# EasyEDA Pro project Access Control Core.eprj, board V2.0.1 LCD Backpack PCB
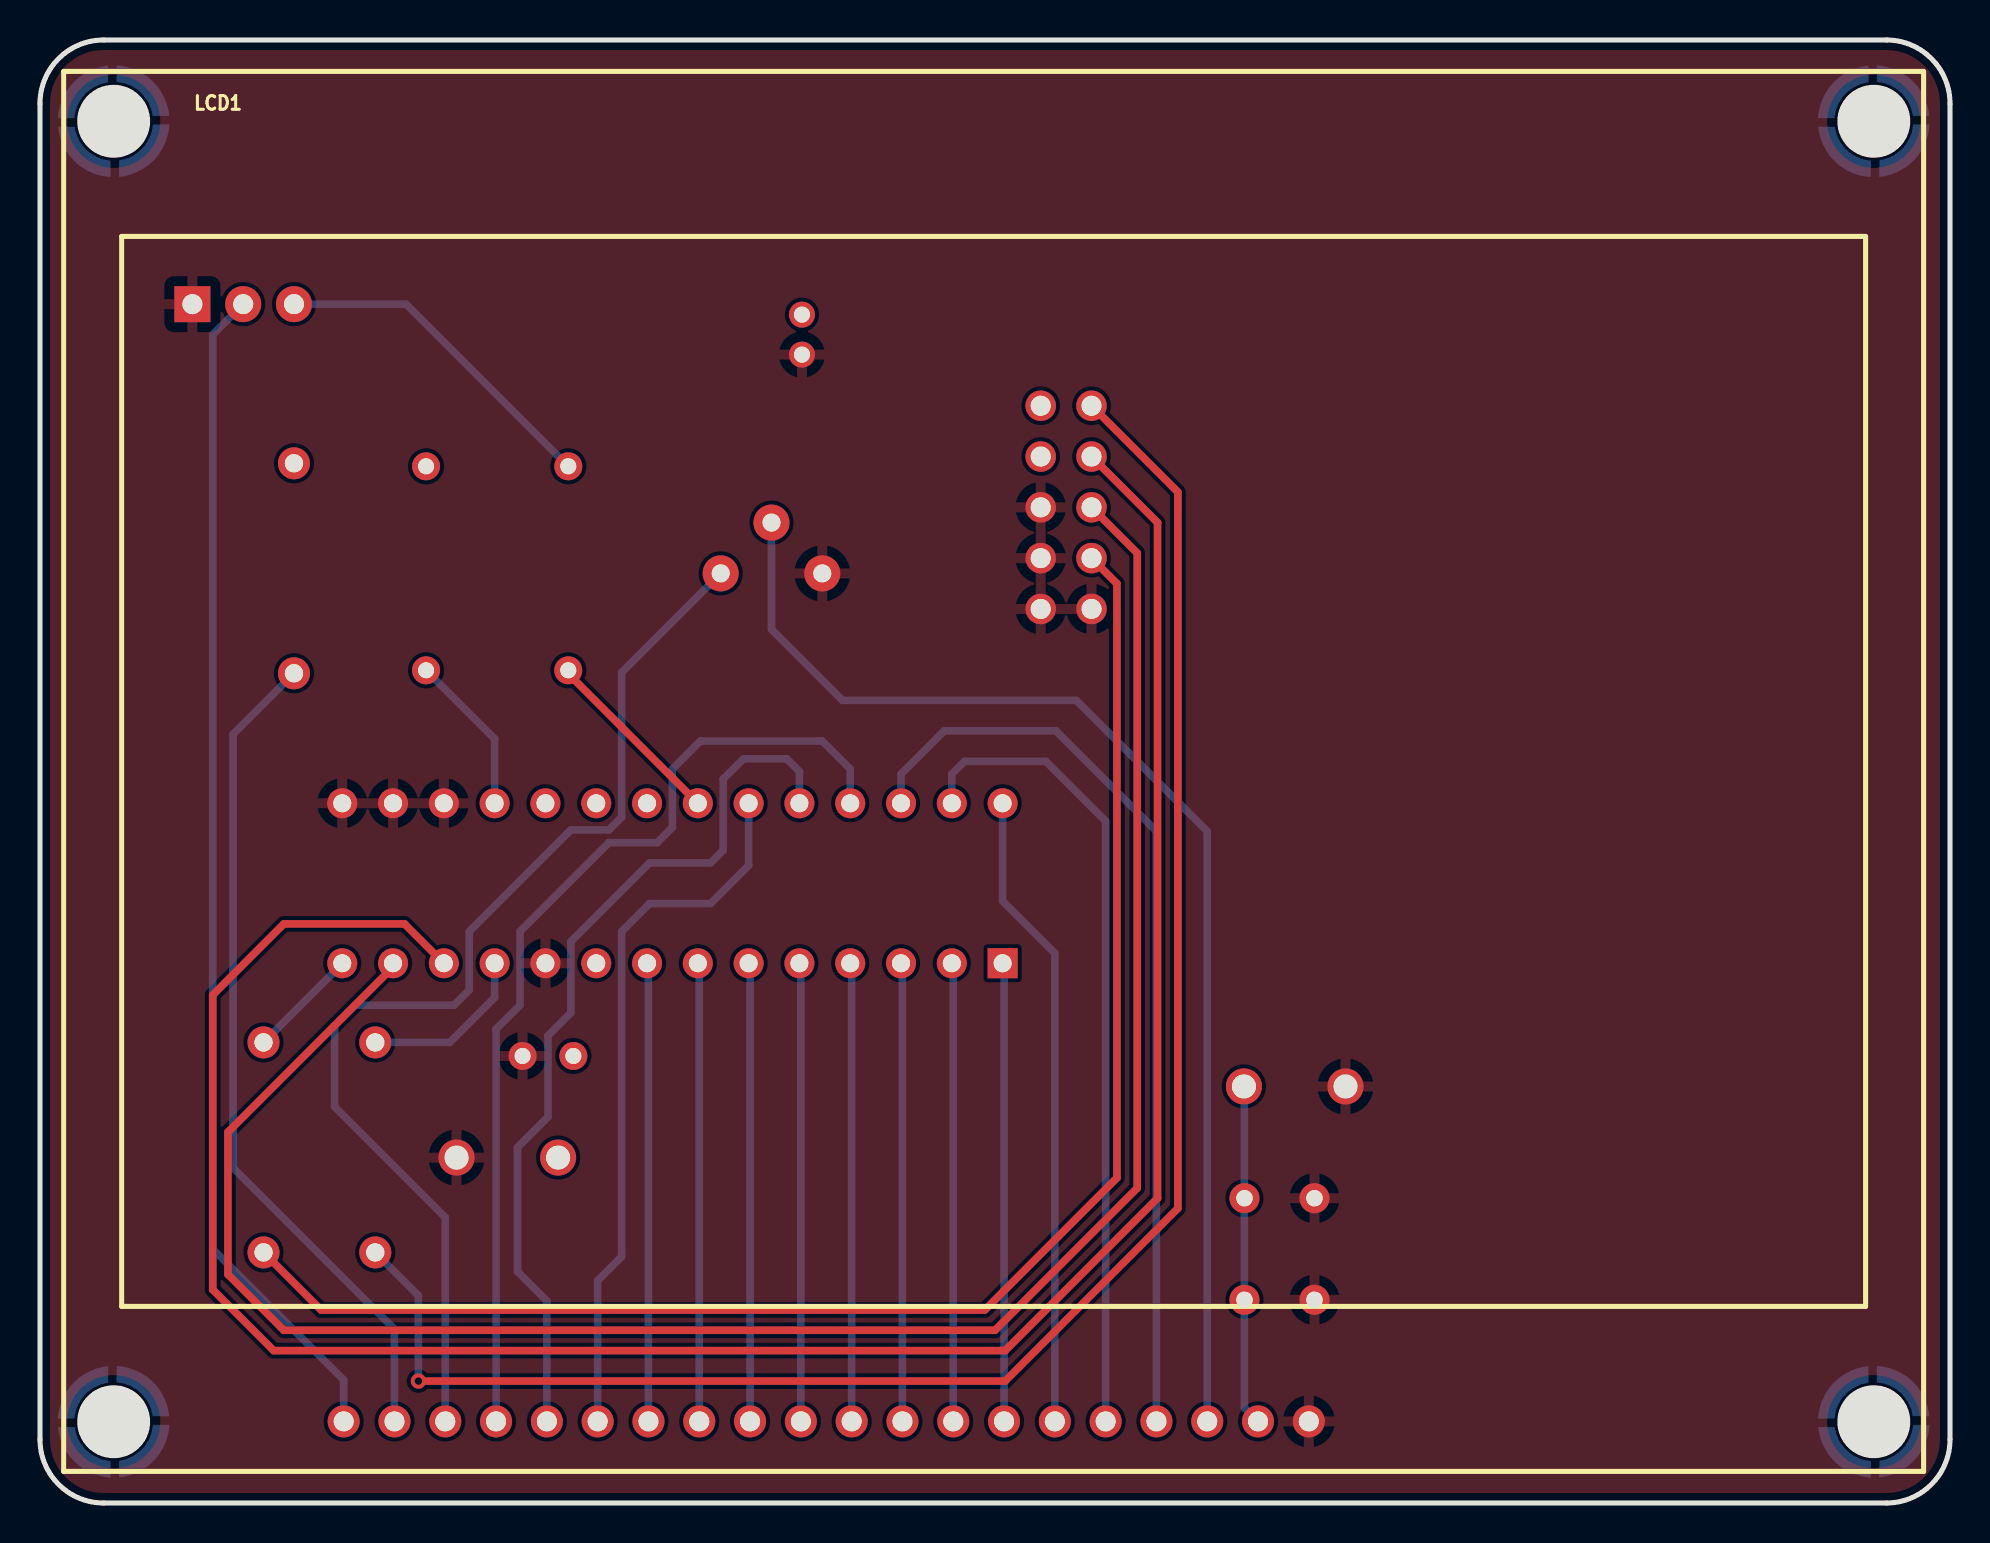
[diagram p13: board, top side]
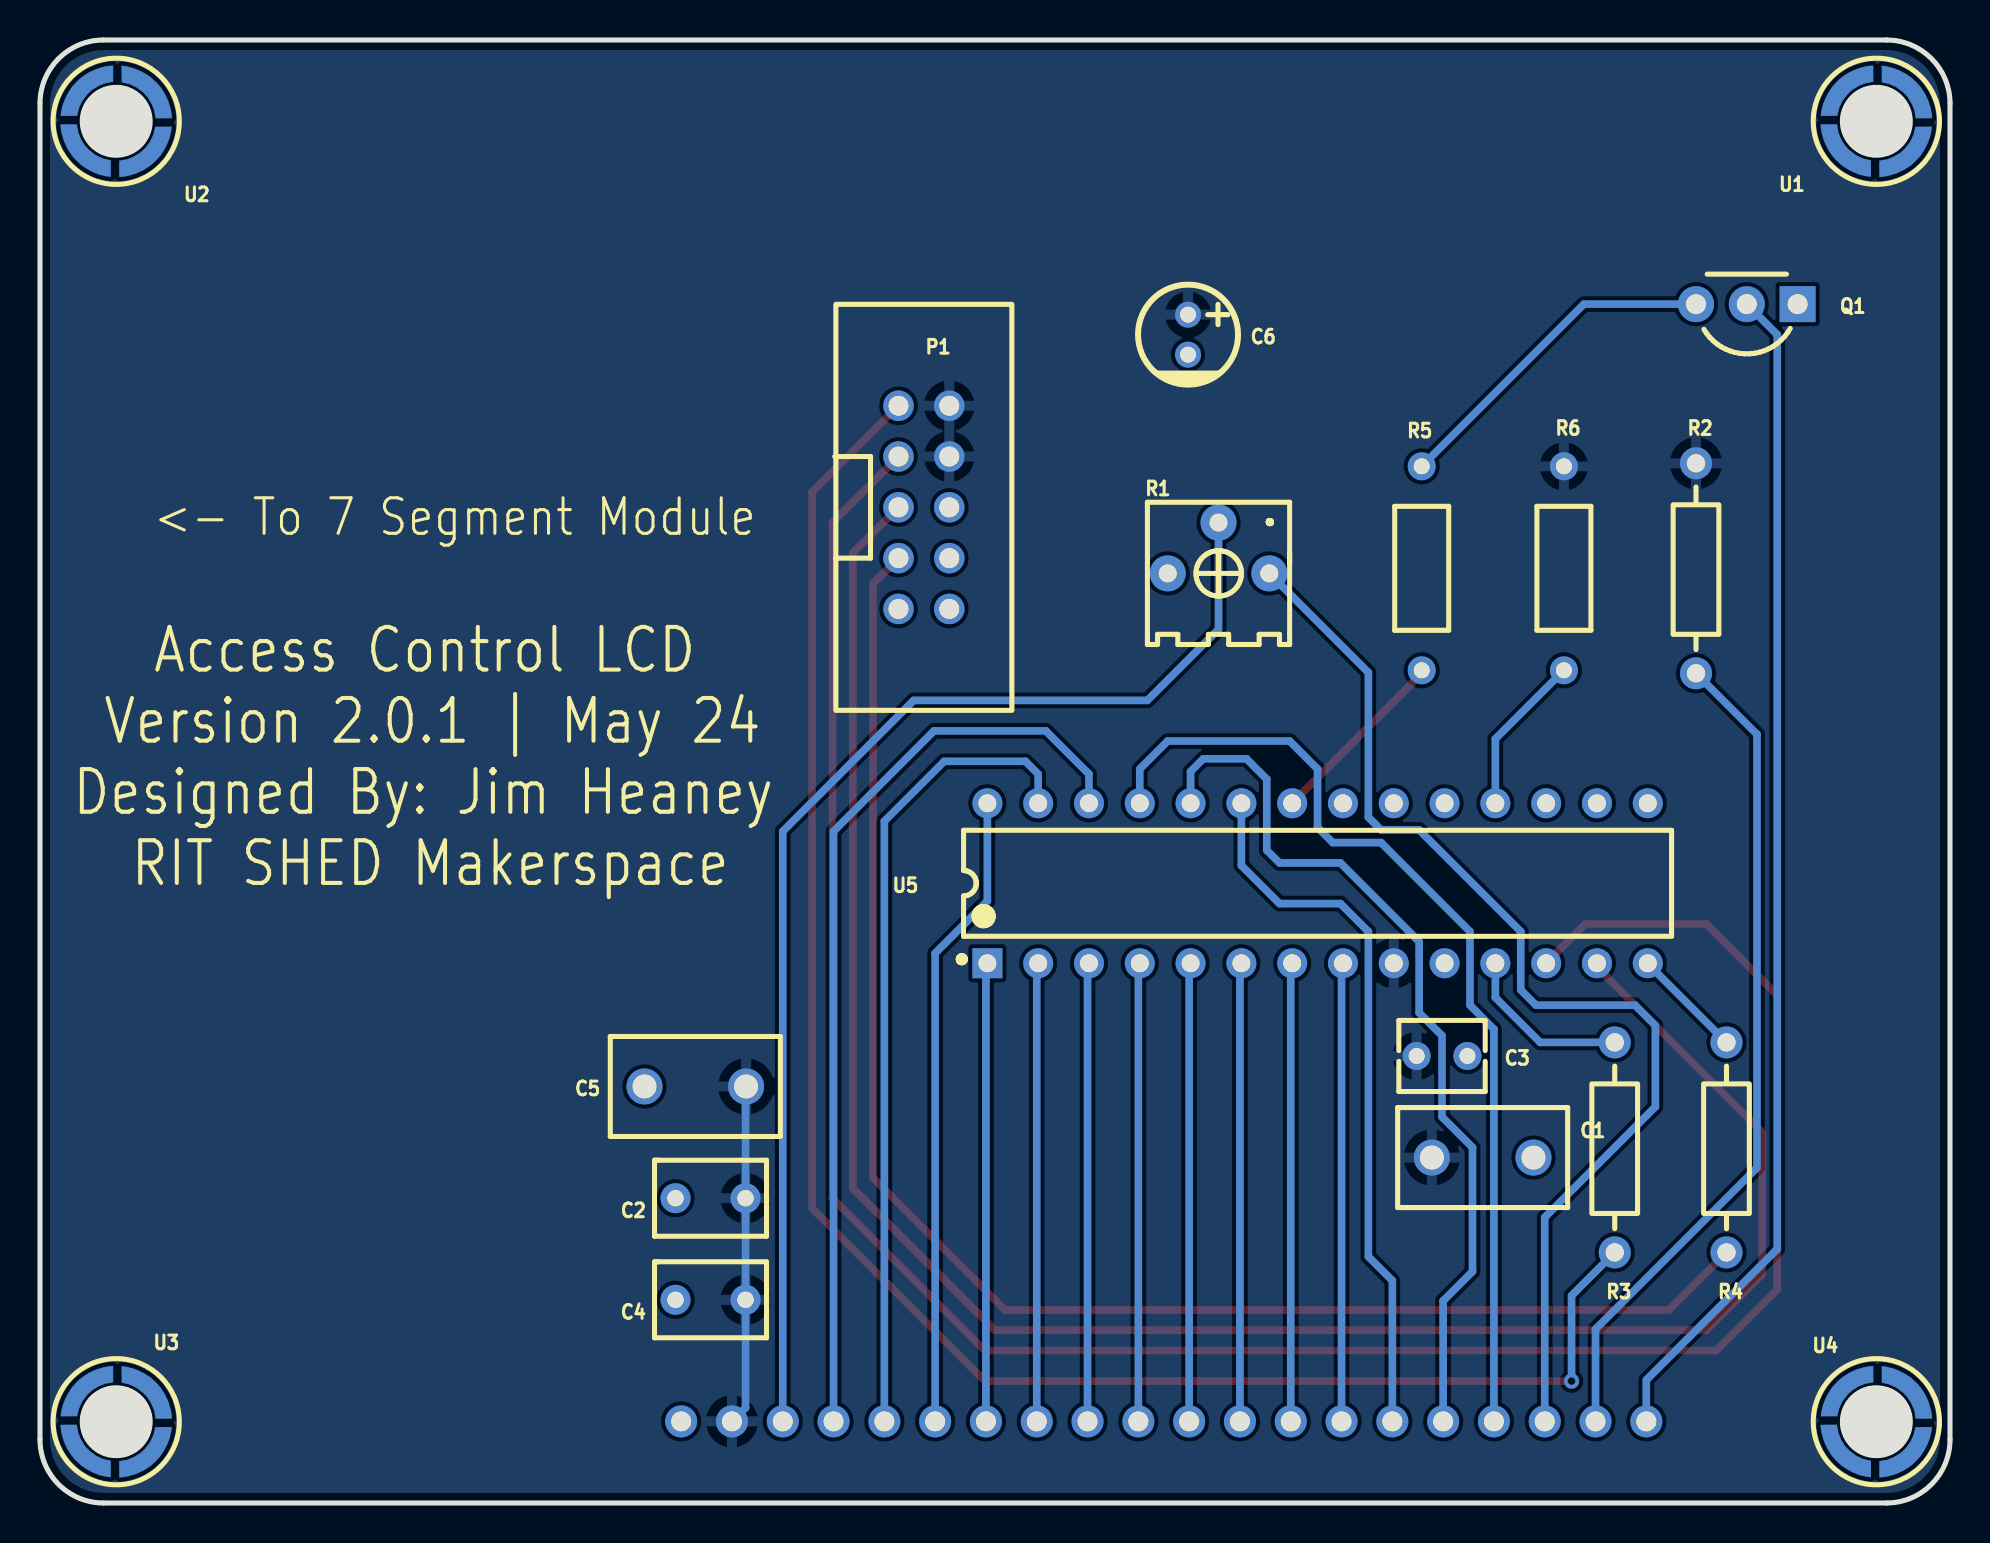
[diagram p14: board, bottom side, seen from below]

Outline 95.5 x 73.15 mm; copper layers: Top Layer, Bottom Layer. Coordinates in mm from the lower left corner of the outline.
Outline path: 0,69.98 0,3.18 arc(0.93,0.93) 3.18,0 92.33,0 arc(94.57,0.93) 95.5,3.18 95.5,69.98 arc(94.57,72.22) 92.33,73.15 3.18,73.15 arc(0.93,72.22) 0,69.98
Stack: Top Layer 0.035mm / Dielectric1 1.51mm FR4 er 4.5 / Bottom Layer 0.035mm

## Design rules (mm)
template: Custom Config
spacing copperThickness1oz (default): track to track 0.13, other pairs 0.152 to 0.5
spacing copperThickness2oz: track to track 0.203, other pairs 0.152 to 0.3
track width copperThickness1oz (default): min 0.127, default 0.254, max 2.54
track width copperThickness2oz: min 0.203, default 0.254, max 2.54
differential pair differentialPair (default): width min 0.127, default 0.254, max 2.54; gap min 0.152, default 0.152
via viaSize (default): diameter min 0.5, default 0.61, max 10; hole min 0.3, default 0.305, max 6.299

## Placement (name value [footprint] x y rotation side)
C1  1uF  [CAP-TH_L8.5-W5.0-P5.00-D1.2]  23.37 17.27 0 bottom
C2  10uF  [CAP-TH_L5.5-W3.8-P3.50-D0.6]  61.98 15.24 180 bottom
C3  100nF  [CAP-TH_L4.2-W3.5-P2.54-D0.5]  25.4 22.35 0 bottom
C4  10uF  [CAP-TH_L5.5-W3.8-P3.50-D0.6]  61.98 10.16 180 bottom
C5  1uF  [CAP-TH_L8.5-W5.0-P5.00-D1.2]  62.74 20.83 180 bottom
C6  100uF  [CAP-TH_BD5.0-P2.00-D0.8-FD]  38.1 58.42 270 bottom
LCD1  HS12864B03  [LCD-TH_L93.0-W65.0_HS12864B03]  39.31 4.08 0 top
P1  2.54-2*5P简牛  [IDC-TH_10P-P2.54_C5665]  51.31 49.78 270 bottom
Q1  2SC945L-P-T92-B  [TO-92-3_L4.8-W3.7-P2.54-L]  10.16 59.94 0 bottom
R1  20kΩ  [RES-ADJ-TH_3P-L7.1-W6.9-P2.50-L_3362P]  36.58 47.75 180 bottom
R2  220Ω  [RES-TH_BD2.2-L6.5-P10.50-D0.6]  12.7 46.74 270 bottom
R3  220Ω  [RES-TH_BD2.2-L6.5-P10.50-D0.6]  16.76 17.78 270 bottom
R4  220Ω  [RES-TH_BD2.2-L6.5-P10.50-D0.6]  11.18 17.78 270 bottom
R5  1kΩ  [RES-TH_BD2.7-L6.2-P10.20-D0.4]  26.42 46.74 90 bottom
R6  10kΩ  [RES-TH_BD2.7-L6.2-P10.20-D0.4]  19.3 46.74 270 bottom
U1  SMTWEM2515STR  [SMD_BD5.0-D3.5]  3.68 69.09 180 bottom
U2  SMTWEM2515STR  [SMD_BD5.0-D3.5]  91.69 69.09 180 bottom
U3  SMTWEM2515STR  [SMD_BD5.0-D3.5]  91.69 4.06 180 bottom
U4  SMTWEM2515STR  [SMD_BD5.0-D3.5]  3.68 4.06 180 bottom
U5  MCP23S17-E/SP  [DIP-28_L34.6-W7.3-P2.54-LS10.2-BL]  31.62 30.99 180 bottom

## Footprints (pads in the part's own frame, mm; a bottom-side part is the same pattern mirrored in y, then rotated)
CAP-TH_BD5.0-P2.00-D0.8-FD
  round 1.3 hole 0.8: 1(-1,0) 2(1,0)
CAP-TH_L4.2-W3.5-P2.54-D0.5
  round 1.4 hole 0.8: 1(-1.27,0) 2(1.27,0)
CAP-TH_L5.5-W3.8-P3.50-D0.6
  round 1.5 hole 0.82: 1(-1.75,0) 2(1.75,0)
CAP-TH_L8.5-W5.0-P5.00-D1.2
  round 1.8 hole 1.2: 1(-2.54,0) 2(2.54,0)
DIP-28_L34.6-W7.3-P2.54-LS10.2-BL
  rect 1.5x1.5 hole 0.9: 1(-16.51,-4)
  round 1.5 hole 0.9: 2(-13.97,-4) 3(-11.43,-4) 4(-8.89,-4) 5(-6.35,-4) 6(-3.81,-4) 7(-1.27,-4) 8(1.27,-4) 9(3.81,-4) 10(6.35,-4) 11(8.89,-4) 12(11.43,-4) 13(13.97,-4) 14(16.51,-4) 15(16.51,4) 16(13.97,4) 17(11.43,4) 18(8.89,4) 19(6.35,4) 20(3.81,4) 21(1.27,4) 22(-1.27,4) 23(-3.81,4) 24(-6.35,4) 25(-8.89,4) 26(-11.43,4) 27(-13.97,4) 28(-16.51,4)
IDC-TH_10P-P2.54_C5665
  round 1.524 hole 1: 1(-5.08,-1.27) 2(-5.08,1.27) 3(-2.54,-1.27) 4(-2.54,1.27) 5(0,-1.27) 6(0,1.27) 7(2.54,-1.27) 8(2.54,1.27) 9(5.08,-1.27) 10(5.08,1.27)
LCD-TH_L93.0-W65.0_HS12864B03
  round 1.6 hole 1: 1(24.13,0) 2(21.59,0) 3(19.05,0) 4(16.51,0) 5(13.97,0) 6(11.43,0) 7(8.89,0) 8(6.35,0) 9(3.81,0) 10(1.27,0) 11(-1.27,0) 12(-3.81,0) 13(-6.35,0) 14(-8.89,0) 15(-11.43,0) 16(-13.97,0) 17(-16.51,0) 18(-19.05,0) 19(-21.59,0) 20(-24.13,0)
RES-ADJ-TH_3P-L7.1-W6.9-P2.50-L_3362P
  round 1.8 hole 0.9: 1(-2.54,-1.27) 2(0,1.27) 3(2.54,-1.27)
RES-TH_BD2.2-L6.5-P10.50-D0.6
  round 1.6 hole 0.914: 1(-5.25,0) 2(5.25,0)
RES-TH_BD2.7-L6.2-P10.20-D0.4
  round 1.4 hole 0.8: 1(-5.1,0) 2(5.1,0)
SMD_BD5.0-D3.5
  custom 2.52x2.628 smd: 1(-1.529,-1.792) 1(1.529,1.792)
  custom 2.629x2.52 smd: 1(-1.466,1.847) 1(1.465,-1.847)
TO-92-3_L4.8-W3.7-P2.54-L
  rect 1.8x1.8 hole 1: 1(-2.54,0)
  round 1.8 hole 1: 2(0,0) 3(2.54,0)

## Nets
As in the schematic.

Pads without a net: U1 1; U2 1; U3 1; U4 1; U5 19 20 21

## Via types
v1: diameter 0.762, hole 0.381, Top Layer to Bottom Layer, 1 via

## Routing (per net, layer and track width the routed paths; a pad name or vN(x,y) marks a point on that pad's centre or on a via; arc(x,y) is an arc through that point)
+5V: length 17.1
  Bottom Layer w0.381: LCD1.2 60.23,4.76 C4.2 C2.2 60.23,20.55 59.94,20.83
CS: length 90.8
  Top Layer w0.381: P1.1 56.9,50.55 56.9,14.73 48.26,6.1 v1(18.92,6.1)
  Bottom Layer w0.381: v1(18.92,6.1) 18.92,10.37 R3.2
CS1: length 35.8
  Bottom Layer w0.381: LCD1.15 27.88,11.12 29.08,12.32 29.08,28.58 30.48,29.97 33.53,29.97 35.43,31.88 35.43,34.99
CS2: length 44.9
  Bottom Layer w0.381: U5.24 37.97,36.58 37.34,37.21 35.18,37.21 34.16,36.19 34.16,32.64 33.53,32 30.48,32 26.54,28.07 26.54,24.51 25.4,23.37 25.4,19.3 23.88,17.78 23.88,11.57 25.34,10.1 LCD1.16
D/I: length 46.7
  Bottom Layer w0.381: LCD1.4 55.82,33.58 50.8,38.61 45.21,38.61 43.05,36.45 43.05,34.99
DB0: length 23
  Bottom Layer w0.381: 48.01,26.99 48.2,26.79 LCD1.7
DB1: length 23
  Bottom Layer w0.381: LCD1.8 45.66,26.79 45.47,26.99
DB2: length 23
  Bottom Layer w0.381: 42.93,26.99 43.12,26.79 LCD1.9
DB3: length 23
  Bottom Layer w0.381: 40.39,26.99 40.58,26.79 LCD1.10
DB4: length 23
  Bottom Layer w0.381: LCD1.11 38.04,26.79 37.85,26.99
DB5: length 23
  Bottom Layer w0.381: LCD1.12 35.5,26.79 35.31,26.99
DB6: length 23
  Bottom Layer w0.381: LCD1.13 32.96,26.79 32.77,26.99
DB7: length 23
  Bottom Layer w0.381: 30.23,26.99 30.42,26.79 LCD1.14
E: length 32
  Bottom Layer w0.381: LCD1.6 50.74,27.49 48.13,30.1 48.13,34.86 48.01,34.99
LEDCTRL: length 9.3
  Top Layer w0.381: R5.1 26.42,41.47 32.89,34.99
LEDK: length 59.2
  Bottom Layer w0.381: LCD1.20 15.18,6.15 8.64,12.7 8.64,58.42 Q1.2
MISO: length 78.1
  Top Layer w0.381: R4.2 14.05,9.65 47.24,9.65 53.85,16.26 53.85,45.97 P1.7
MOSI: length 103.5
  Top Layer w0.381: 17.65,26.99 17.65,26.8 9.4,18.54 9.4,11.43 12.19,8.64 47.75,8.64 54.86,15.75 54.86,47.5 P1.5
R/W: length 40.7
  Bottom Layer w0.381: LCD1.5 53.28,34.09 50.29,37.08 46.23,37.08 45.59,36.45 U5.27
RST: length 49.5
  Bottom Layer w0.381: LCD1.17 22.8,23.69 24,24.89 24,28.58 28.45,33.02 30.86,33.02 31.62,33.78 31.62,36.7 33.02,38.1 39.12,38.1 40.51,36.7 40.51,34.99
SCK: length 118.7
  Top Layer w0.381: P1.3 55.88,49.02 55.88,15.24 48.26,7.62 11.68,7.62 8.64,10.67 8.64,25.4 12.19,28.96 18.23,28.96 U5.12
$1N391: length 60.8
  Bottom Layer w0.381: R1.2 36.58,43.69 40.13,40.13 51.82,40.13 58.36,33.58 LCD1.3
$1N397: length 56.7
  Bottom Layer w0.381: LCD1.18 20.26,14.28 14.73,19.81 14.73,23.88 15.75,24.89 20.7,24.89 21.46,25.65 21.46,28.58 26.54,33.66 28.45,33.66 29.08,34.29 29.08,41.53 R1.3
$1N591: length 42
  Bottom Layer w0.381: R2.2 9.65,38.44 9.65,16.76 17.72,8.69 LCD1.19
$1N1010: length 8.1
  Bottom Layer w0.381: 22.73,34.99 22.73,38.21 R6.2
$1N1103: length 8.6
  Bottom Layer w0.381: R3.1 20.49,23.03 22.73,25.27 22.73,26.99
$1N1151: length 5.6
  Bottom Layer w0.381: R4.1 15.11,26.97 15.11,26.99
$1N2353: length 17.1
  Bottom Layer w0.381: R5.2 18.31,59.94 Q1.3

## Copper pours and planes (outline as drawn; the poured copper is in the pictures)
+5V on Bottom Layer: -11.68,73.66 104.65,73.66 104.65,-0.51 -11.68,-0.51
GND on Top Layer: 0,77.72 95.5,77.72 95.5,-9.65 0,-9.65

## Text on the board
Bottom Silkscreen Layer: <- To 7 Segment Module | Access Control LCD | RIT SHED Makerspace | Version 2.0.1 | May 24 | Designed By: Jim Heaney
